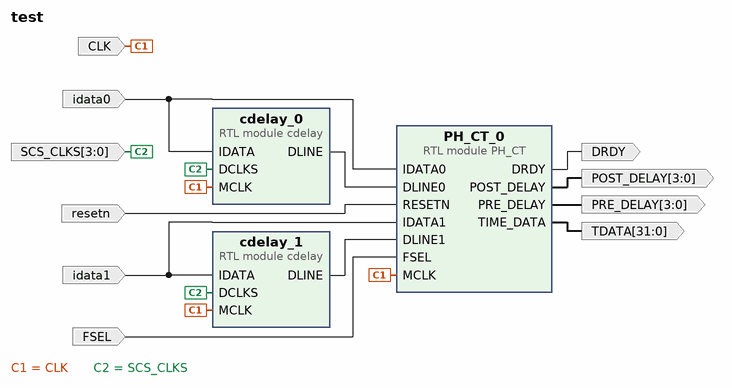
[diagram p0: block diagram of the top level]
# Vivado block design test, xc7z020clg400-1, Vivado 2019.1
create_bd_design test

create_bd_port -dir I resetn
create_bd_port -dir I -type clk CLK
set_property -dict {CONFIG.FREQ_HZ 100000000} [get_bd_ports CLK]
create_bd_port -dir I idata0
create_bd_port -dir I idata1
create_bd_port -dir I FSEL
create_bd_port -dir O -from 31 -to 0 -type data TDATA
create_bd_port -dir O -type data DRDY
create_bd_port -dir O -from 3 -to 0 -type data PRE_DELAY
create_bd_port -dir O -from 3 -to 0 -type data POST_DELAY
create_bd_port -dir I -from 3 -to 0 -type clk SCS_CLKS
set_property -dict {CONFIG.FREQ_HZ 460000000} [get_bd_ports SCS_CLKS]

create_bd_cell -type module -reference PH_CT PH_CT_0
create_bd_cell -type module -reference cdelay cdelay_0
create_bd_cell -type module -reference cdelay cdelay_1

# ---- connections ----

connect_bd_net [get_bd_ports resetn] [get_bd_pins PH_CT_0/RESETN]
connect_bd_net -net clk_wiz_0_clk_out1 [get_bd_ports CLK] [get_bd_pins PH_CT_0/MCLK] [get_bd_pins cdelay_0/MCLK] [get_bd_pins cdelay_1/MCLK]
connect_bd_net -net xlconcat_0_dout [get_bd_ports SCS_CLKS] [get_bd_pins cdelay_0/DCLKS] [get_bd_pins cdelay_1/DCLKS]
connect_bd_net [get_bd_ports idata0] [get_bd_pins PH_CT_0/IDATA0] [get_bd_pins cdelay_0/IDATA]
connect_bd_net -net idata1_1 [get_bd_ports idata1] [get_bd_pins PH_CT_0/IDATA1] [get_bd_pins cdelay_1/IDATA]
connect_bd_net [get_bd_pins cdelay_0/DLINE] [get_bd_pins PH_CT_0/DLINE0]
connect_bd_net [get_bd_pins cdelay_1/DLINE] [get_bd_pins PH_CT_0/DLINE1]
connect_bd_net [get_bd_ports FSEL] [get_bd_pins PH_CT_0/FSEL]
connect_bd_net [get_bd_pins PH_CT_0/TIME_DATA] [get_bd_ports TDATA]
connect_bd_net [get_bd_pins PH_CT_0/DRDY] [get_bd_ports DRDY]
connect_bd_net [get_bd_pins PH_CT_0/PRE_DELAY] [get_bd_ports PRE_DELAY]
connect_bd_net [get_bd_pins PH_CT_0/POST_DELAY] [get_bd_ports POST_DELAY]

validate_bd_design
save_bd_design
